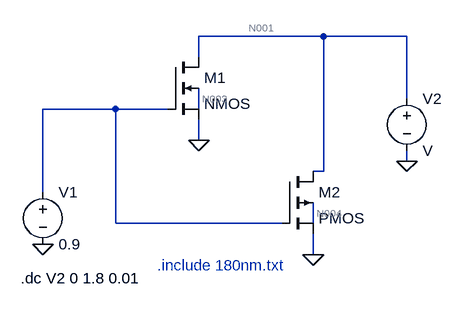
[diagram p0: schematic Draft6.asc]
Draft6.asc, the LTspice schematic file:
Version 4
SHEET 1 880 680
WIRE 432 48 240 48
WIRE 560 48 432 48
WIRE 240 80 240 48
WIRE 560 144 560 48
WIRE 112 160 0 160
WIRE 192 160 112 160
WIRE 240 160 240 128
WIRE 240 208 240 176
WIRE 560 240 560 224
WIRE 432 256 432 48
WIRE 432 256 416 256
WIRE 0 288 0 160
WIRE 112 336 112 160
WIRE 368 336 112 336
WIRE 416 336 416 304
WIRE 416 384 416 352
FLAG 560 240 0
FLAG 0 368 0
FLAG 240 208 0
FLAG 416 384 0
SYMBOL nmos4 192 80 R0
SYMATTR InstName M1
SYMBOL pmos4 368 256 R0
SYMATTR InstName M2
SYMBOL voltage 0 272 R0
WINDOW 123 0 0 Left 2
WINDOW 39 0 0 Left 2
SYMATTR InstName V1
SYMATTR Value 0.9
SYMBOL voltage 560 128 R0
SYMATTR InstName V2
TEXT 176 400 Left 2 ;.include 180nm.txt
TEXT -34 420 Left 2 !.dc V2 0 1.8 0.01

The netlist it stands for:
* Draft6.asc
M1 N001 N002 0 N003 NMOS
M2 N001 N002 0 N004 PMOS
V1 N002 0 0.9
V2 N001 0 V
.model NMOS NMOS
.model PMOS PMOS
.lib standard.mos
* .include 180nm.txt
.dc V2 0 1.8 0.01
.backanno
.end

* Results of the author's LTspice run, read from the files saved beside the schematic
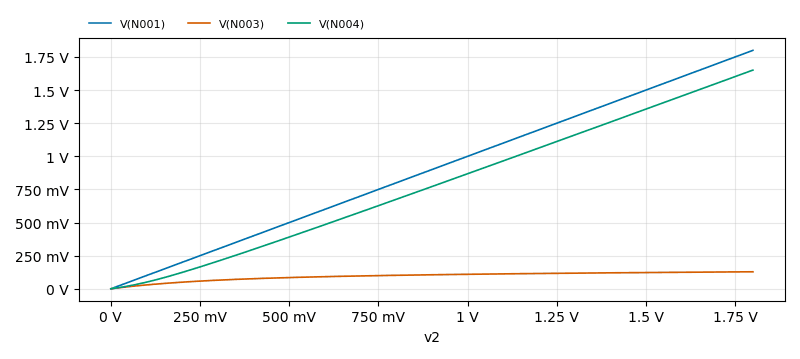
[diagram p1: DC transfer characteristic of Draft6.asc, plotted from the saved traces]
* DC transfer characteristic, 1 run:
*   V(N001): 0 V at v2=0 V, 1.8 V at v2=1.8 V, min 0 V, max 1.8 V
*   V(N003): 5.584e-08 fV at v2=0 V, 128.4 mV at v2=1.8 V, min 5.584e-08 fV, max 128.4 mV
*   V(N004): -0.1143 fV at v2=0 V, 1.651 V at v2=1.8 V, min -0.1143 fV, max 1.651 V